# EAGLE design untitled (EAGLE 9.6.2)
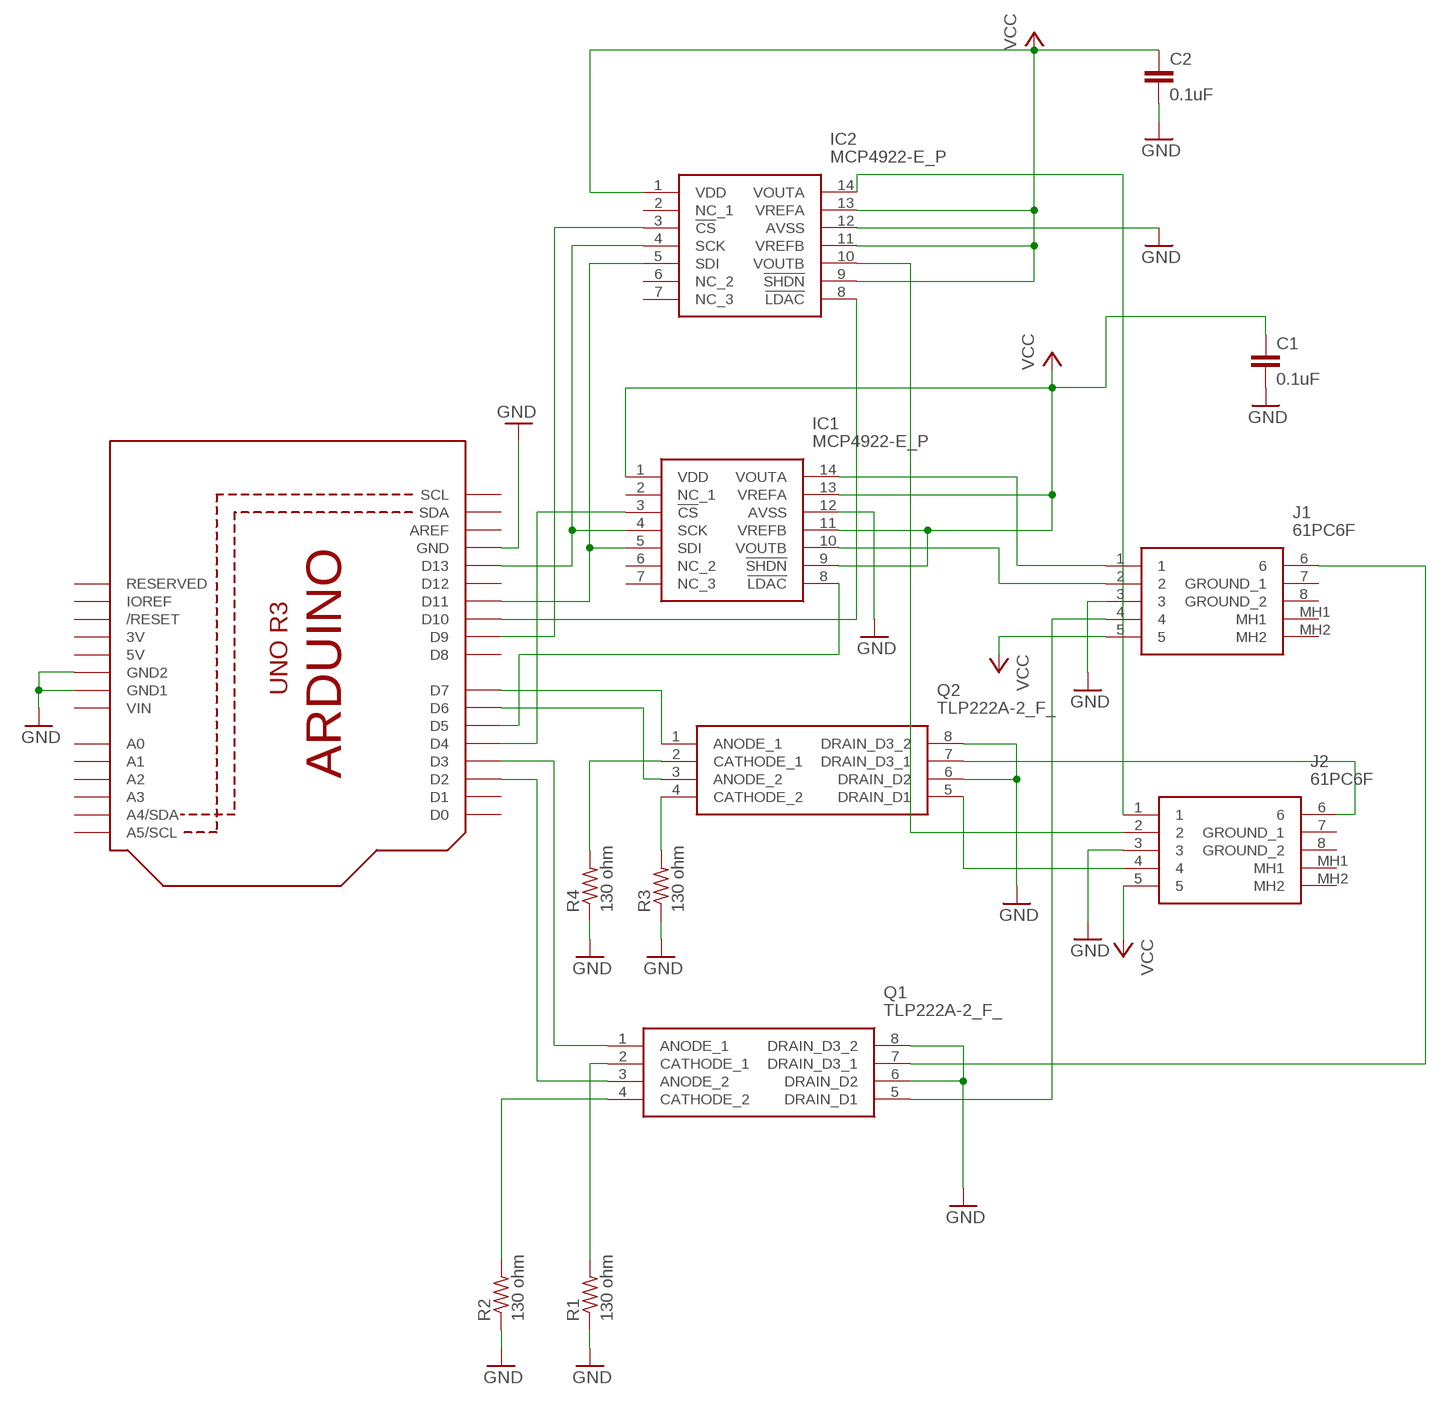
[diagram p0: schematic, sheet 1]

## Parts
C1  0.1uF  C-EU050-024X044  [C050-024X044]
C2  0.1uF  C-EU050-024X044  [C050-024X044]
IC1  MCP4922-E_P  [DIP794W56P254L1905H432Q14N]
IC2  MCP4922-E_P  [DIP794W56P254L1905H432Q14N]
J1  61PC6F  [61PC6F]
J2  61PC6F  [61PC6F]
Q1  TLP222A-2_F_  [DIP762W60P254L966H485Q8N]
Q2  TLP222A-2_F_  [DIP762W60P254L966H485Q8N]
R1  130 ohm  R-US_0207/7  [0207/7]
R2  130 ohm  R-US_0207/7  [0207/7]
R3  130 ohm  R-US_0207/7  [0207/7]
R4  130 ohm  R-US_0207/7  [0207/7]
U1  ARDUINOR3-BPLACE  [ARDUINOR3-BPLACE]

## Nets
GND: C1.2 C2.2 IC1.12(AVSS) IC2.12(AVSS) J1.3 J2.3 Q1.6(DRAIN_D2) Q1.8(DRAIN_D3_2) Q2.6(DRAIN_D2) Q2.8(DRAIN_D3_2) R1.1 R2.1 R3.1 R4.1 U1.GND U1.GND1 U1.GND2
N$1: IC1.4(SCK) IC2.4(SCK) U1.D13
N$2: IC1.5(SDI) IC2.5(SDI) U1.D11
N$3: Q1.2(CATHODE_1) R1.2
N$4: IC1.3(!CS) U1.D4
N$5: IC1.8(!LDAC) U1.D5
N$6: Q1.4(CATHODE_2) R2.2
N$7: Q1.1(ANODE_1) U1.D3
N$8: Q1.3(ANODE_2) U1.D2
N$9: Q2.1(ANODE_1) U1.D7
N$10: J1.6 Q1.7(DRAIN_D3_1)
N$11: J1.4 Q1.5(DRAIN_D1)
N$12: IC1.14(VOUTA) J1.1
N$13: Q2.3(ANODE_2) U1.D6
N$14: IC1.10(VOUTB) J1.2
N$15: Q2.2(CATHODE_1) R4.2
N$16: Q2.4(CATHODE_2) R3.2
N$17: J2.6 Q2.7(DRAIN_D3_1)
N$18: J2.4 Q2.5(DRAIN_D1)
N$20: IC2.3(!CS) U1.D9
N$21: IC2.10(VOUTB) J2.2
N$22: IC2.8(!LDAC) U1.D10
N$23: IC2.14(VOUTA) J2.1
VCC: C1.1 C2.1 IC1.1(VDD) IC1.9(!SHDN) IC1.11(VREFB) IC1.13(VREFA) IC2.1(VDD) IC2.9(!SHDN) IC2.11(VREFB) IC2.13(VREFA) J1.5 J2.5
Unconnected: IC1.2(NC_1) IC1.6(NC_2) IC1.7(NC_3) IC2.2(NC_1) IC2.6(NC_2) IC2.7(NC_3) J1.7(GROUND_1) J1.8(GROUND_2) J1.MH1 J1.MH2 J2.7(GROUND_1) J2.8(GROUND_2) J2.MH1 J2.MH2 U1.A0 U1.A1 U1.A2 U1.A3 U1.A4(A4/SDA) U1.A5(A5/SCL) U1.AREF U1.D0 U1.D1 U1.D8 U1.D12 U1.IOREF U1.RESERVED U1.RESET(/RESET) U1.SCL U1.SDA

## Power pins joined to a net without a drawn wire
3V: U1.3V
5V: U1.5V
VIN: U1.VIN

## Library data of the parts
C1 C2 = rcl:C-EU: CAPACITOR, European symbol; SPICEPREFIX: C
IC1 IC2 = SamacSys_Parts:MCP4922-E_P: Microchip MCP4922-E/P, 2-channel 12 bit Serial DAC, 14-Pin PDIP Source: Datasheet <https://componentsearchengine.com/Datasheets/1/MCP4922-E_P.pdf>; DESCRIPTION: Microchip MCP4922-E/P, 2-channel 12 bit Serial DAC, 14-Pin PDIP; HEIGHT: 4.32mm; MANUFACTURER_NAME: Microchip; MANUFACTURER_PART_NUMBER: MCP4922-E/P; MOUSER_PART_NUMBER: 579-MCP4922-E/P; MOUSER_PRICE-STOCK: https://www.mouser.com/Search/Refine.aspx?Keyword=579-MCP4922-E%2FP
J1 J2 = SamacSys_Parts:61PC6F: Conn Circular DIN F 6 POS Solder RA Thru-Hole 6 Terminal 1 Port Source: Datasheet <https://componentsearchengine.com/Datasheets/1/61PC6F.pdf>; DESCRIPTION: Conn Circular DIN F 6 POS Solder RA Thru-Hole 6 Terminal 1 Port; HEIGHT: 21mm; MANUFACTURER_NAME: Switchcraft; MANUFACTURER_PART_NUMBER: 61PC6F; MOUSER_PART_NUMBER: 502-61PC6F; MOUSER_PRICE-STOCK: https://www.mouser.com/Search/Refine.aspx?Keyword=502-61PC6F
Q1 Q2 = SamacSys_Parts:TLP222A-2_F_: MOSFET Output Optocouplers Photorelay Voff=60V Ion=0.5/0.4A dual Source: Datasheet <https://componentsearchengine.com/Datasheets/1/TLP222A-2(F).pdf>; DESCRIPTION: MOSFET Output Optocouplers Photorelay Voff=60V Ion=0.5/0.4A dual; HEIGHT: 4.85mm; MANUFACTURER_NAME: Toshiba; MANUFACTURER_PART_NUMBER: TLP222A-2(F); MOUSER_PART_NUMBER: 757-TLP222A-2(F); MOUSER_PRICE-STOCK: https://www.mouser.com/Search/Refine.aspx?Keyword=757-TLP222A-2%28F%29
R1-R4 = adafruit:R-US_: RESISTOR, American symbol
U1 = adafruit:ARDUINOR3: This is a new object for the new Arduino R3 - with extra pins that you may want to use (such as IOref, and duplicated A4/A5

## Board
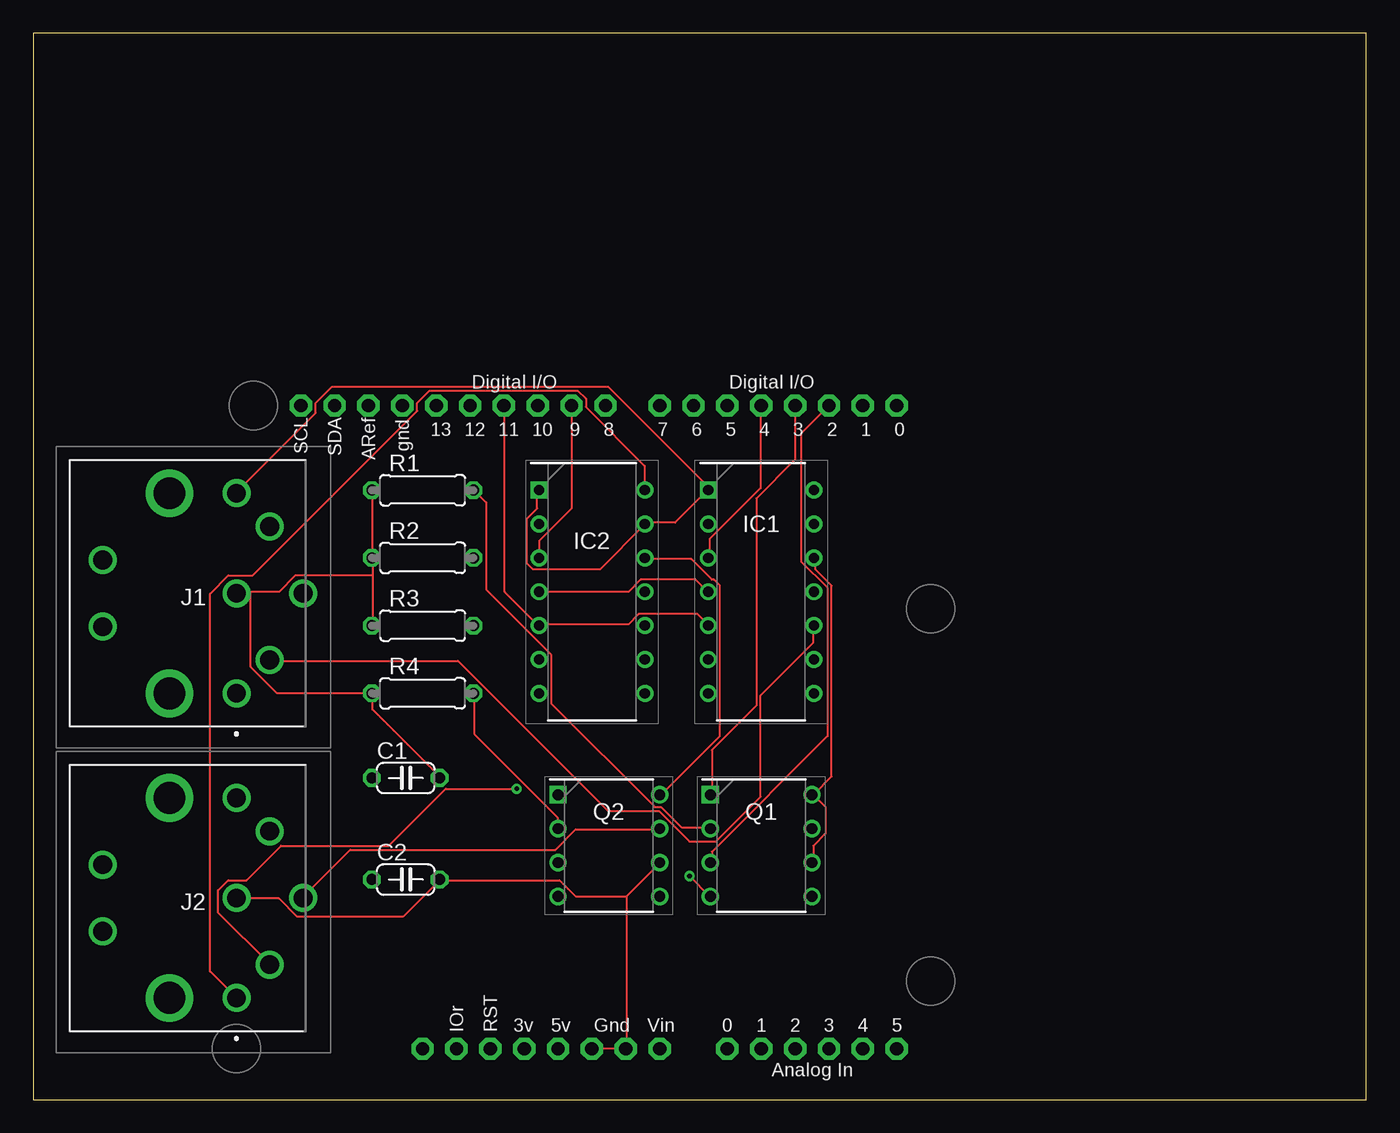
[diagram p1: board, top side]
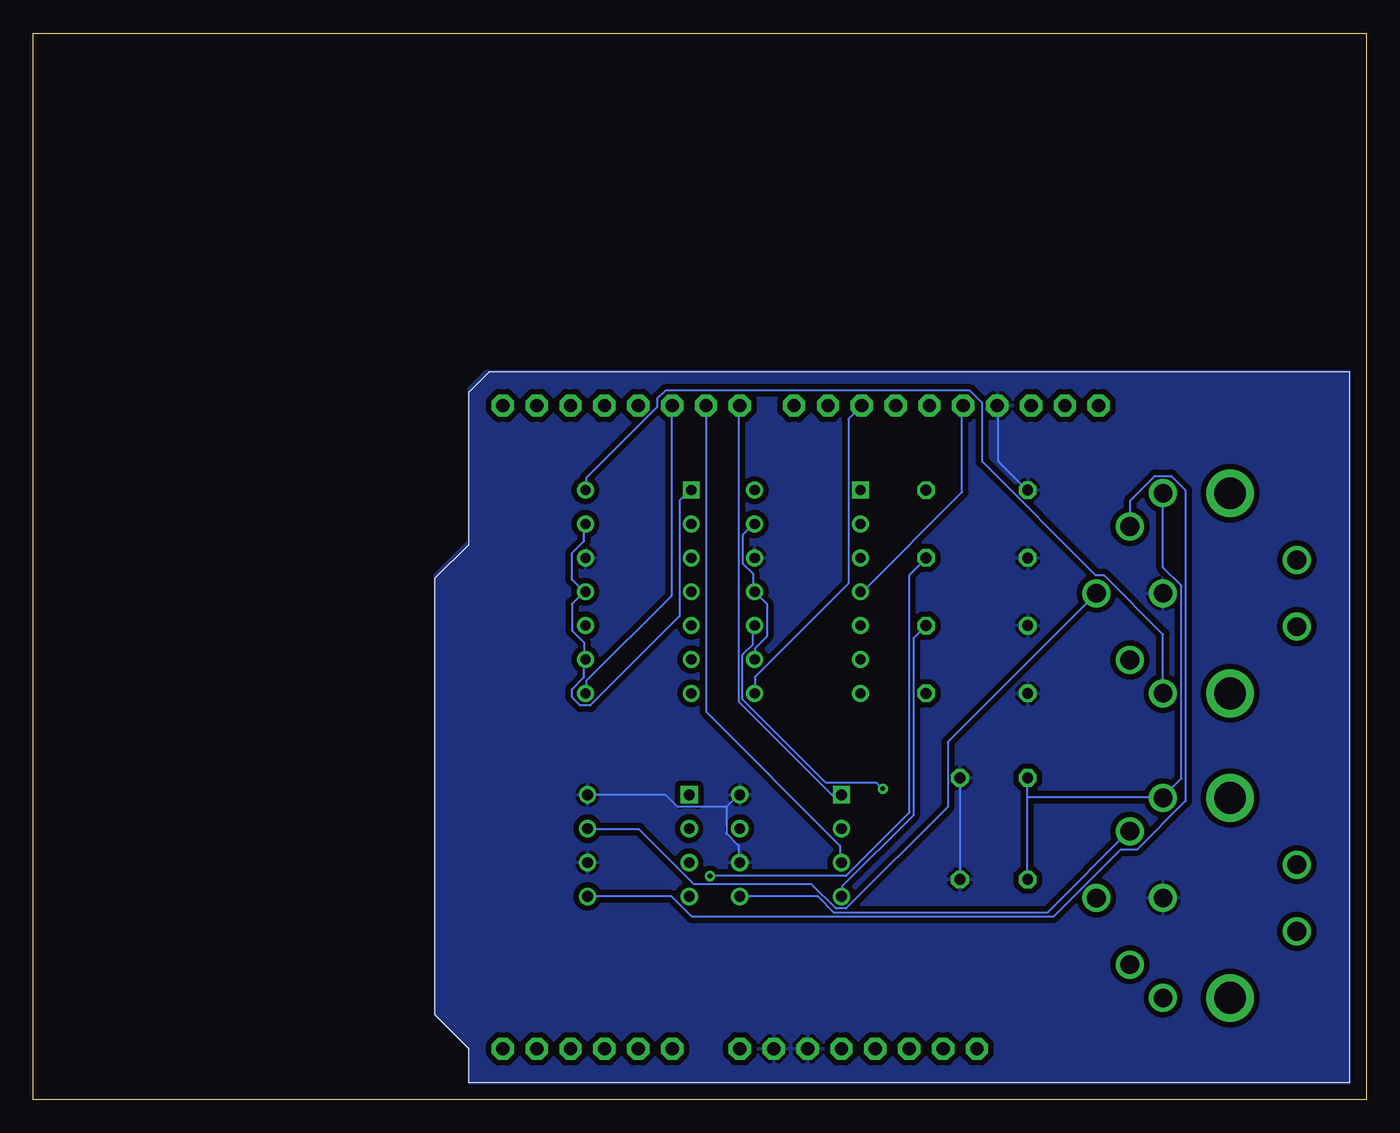
[diagram p2: board, bottom side, seen from below]

Size 100 x 80 mm. Coordinates in mm from the lower left corner, seen from the top.
Outline: 0,0 100,0 100,80 0,80 0,0
Copper layers (1*16): Top 0.035mm / dielectric 1.5mm / Bottom 0.035mm
Design rules "default": minimum track width 6mil, minimum drill 0.35mm, track to track 6mil, track to pad 6mil, pad to pad 6mil, via to via 6mil, smd to smd 6mil, copper to edge 40mil, drill to drill 6mil, minimum pad ring 10mil, minimum via ring 8mil, stop-mask expansion 4mil, vias tented up to drill 0mil, thermal gap 10mil

### Footprints (pad centres in the part's own frame; a part is rotated, then mirrored left to right if it is on the bottom)
C050-024X044 = drill 0.813 octagon: 1 -2.54,0; 2 2.54,0
DIP794W56P254L1905H432Q14N = drill 0.76 pad 1.16 square: 1 -3.97,7.62 | drill 0.76 pad 1.16: 2 -3.97,5.08; 3 -3.97,2.54; 4 -3.97,0; 5 -3.97,-2.54; 6 -3.97,-5.08; 7 -3.97,-7.62; 8 3.97,-7.62; 9 3.97,-5.08; 10 3.97,-2.54; 11 3.97,0; 12 3.97,2.54; 13 3.97,5.08; 14 3.97,7.62
61PC6F = drill 1.4 pad 2.1: 1 0,0; 2 2.49,2.5; 3 0,7.505; 4 2.49,12.51; 5 0,15.01; 6 5,7.505; 7 -10.03,5.005; 8 -10.03,10.005 | drill 2.39 pad 3.585: MH1 -5.03,15.01; MH2 -5.03,0
DIP762W60P254L966H485Q8N = drill 0.8 pad 1.2 square: 1 -3.81,3.81 | drill 0.8 pad 1.2: 2 -3.81,1.27; 3 -3.81,-1.27; 4 -3.81,-3.81; 5 3.81,-3.81; 6 3.81,-1.27; 7 3.81,1.27; 8 3.81,3.81
0207/7 = drill 0.813 octagon: 1 -3.81,0; 2 3.81,0
ARDUINOR3-BPLACE = drill 1 pad 1.676 octagon: 3V 35.56,2.54; 5V 38.1,2.54; A0 50.8,2.54; A1 53.34,2.54; A2 55.88,2.54; A3 58.42,2.54; A4 60.96,2.54; A5 63.5,2.54; AREF 23.876,50.8; D0 63.5,50.8; D1 60.96,50.8; D2 58.42,50.8; D3 55.88,50.8; D4 53.34,50.8; D5 50.8,50.8; D6 48.26,50.8; D7 45.72,50.8; D8 41.656,50.8; D9 39.116,50.8; D10 36.576,50.8; D11 34.036,50.8; D12 31.496,50.8; D13 28.956,50.8; GND 26.416,50.8; GND1 43.18,2.54; GND2 40.64,2.54; IOREF 30.48,2.54; RESERVED 27.94,2.54; RESET 33.02,2.54; SCL 18.796,50.8; SDA 21.336,50.8; VIN 45.72,2.54

### Placement (x,y rotation side)
C1  27.94,24.13 0 top
C2  27.94,16.51 0 top
IC1  54.61,38.1 0 top
IC2  41.91,38.1 0 top
J1  15.24,30.48 0 top
J2  15.24,7.62 0 top
Q1  54.61,19.05 0 top
Q2  43.18,19.05 0 top
R1  29.21,45.72 0 top
R2  29.21,40.64 0 top
R3  29.21,35.56 0 top
R4  29.21,30.48 0 top
U1  1.27,1.27 0 top

### Tracks (layer width: path | path; a pad name or v marks a point on that pad's centre or on a via)
GND
  Top 0.152: 58.52,22.86 59.89,24.23 59.89,38.56 58.67,39.78 58.67,40.54 IC1.12 | 58.52,22.86 59.44,21.95 59.44,19.96 58.52,19.05 58.52,17.83 Q1.6 | 58.52,22.86 Q1.8 | U1.GND2 U1.GND1 44.5,3.81 44.5,15.24 | IC2.12 46.02,40.54 49.38,40.54 50.9,39.01 51.05,39.01 51.51,38.56 51.51,27.28 47.09,22.86 Q2.8 | 44.5,15.24 46.94,17.68 Q2.6 | 25.45,39.32 25.45,40.54 R2.1 25.45,40.69 25.45,45.72 R1.1 | 25.45,39.32 25.45,35.66 R3.1 | 16.31,38.1 18.44,38.1 19.66,39.32 25.45,39.32 | 16.31,38.1 15.24,38.1 J1.3 | C1.2 30.48,24.23 25.45,29.26 25.45,30.48 R4.1 18.29,30.48 16.31,32.46 16.31,38.1 | 30.48,16.46 27.74,13.72 19.81,13.72 18.44,15.09 15.24,15.09 J2.3 | 44.5,15.24 40.69,15.24 39.47,16.46 30.48,16.46 | 30.48,16.46 C2.2
  Bottom 0.152: 48.01,21.95 48.01,19.96 47.09,19.05 47.09,17.83 Q2.6 | 48.01,21.95 47.09,22.86 Q2.8 | Q1.8 52.58,22.86 51.66,21.95 48.01,21.95 | U1.GND 27.58,51.97 27.58,47.85 25.45,45.72 R1.1 | C1.2 C2.2
  pour Bottom (isolate 0.406): 1.27,54.61 66.04,54.61 67.31,53.34 67.31,41.91 69.85,39.37 69.85,6.35 67.31,3.81 67.31,1.27 1.27,1.27
N$1
  Top 0.152: IC2.4 44.65,38.1 45.57,39.01 49.68,39.01 50.6,38.1 IC1.4
  Bottom 0.152: U1.D13 30.33,51.97 30.33,45.57 37.8,38.1 IC2.4
N$2
  Top 0.152: IC1.5 50.6,35.66 49.84,36.42 45.41,36.42 44.65,35.66 37.95,35.66 IC2.5 37.8,35.66 35.36,38.1 35.36,51.97 U1.D11
N$3
  Top 0.152: Q1.2 50.75,20.42 48.62,20.42 47.09,21.95 46.63,21.95 38.86,29.72 38.86,33.38 33.98,38.25 33.98,44.81 33.07,45.72 R1.2
N$4
  Top 0.152: IC1.3 50.75,40.69 50.75,42.06 54.56,45.87 54.56,51.97 U1.D4
N$5
  Bottom 0.152: IC1.8 58.52,30.48 58.52,31.39 52.12,37.8 52.12,51.97 U1.D5
N$6  (via drill 0.35)
  Top 0.152: v49.23,16.76 50.75,15.24 Q1.4
  Bottom 0.152: v49.23,16.76 39.01,16.76 34.29,21.49 34.29,39.32 33.07,40.54 R2.2
N$7
  Top 0.152: U1.D3 57.15,48.01 54.25,45.11 54.25,29.57 50.9,26.21 50.9,22.86 Q1.1
N$8
  Top 0.152: U1.D2 57.61,49.99 57.61,40.39 59.59,38.41 59.59,27.28 50.9,18.59 50.9,17.83 Q1.3
N$9
  Bottom 0.152: Q2.1 40.08,22.86 47.09,29.87 47.09,51.97 U1.D7
N$10
  Bottom 0.152: Q1.7 58.37,20.27 54.56,20.27 50.44,16.15 41.6,16.15 39.78,14.33 39.01,14.33 31.39,21.95 31.39,26.82 20.27,37.95 J1.6
N$11
  Bottom 0.152: Q1.5 52.12,15.24 50.6,13.72 23.47,13.72 18.44,18.75 17.22,18.75 13.56,22.4 13.56,45.72 14.63,46.79 15.85,46.79 17.68,44.96 17.68,43.13 J1.4
N$12
  Bottom 0.152: J1.1 15.24,34.9 19.66,39.32 20.27,39.32 28.8,47.85 28.8,52.27 29.72,53.19 52.58,53.19 53.19,52.58 53.19,51.97 58.52,46.63 58.52,45.72 IC1.14
N$13
  Bottom 0.152: U1.D6 49.53,29.11 39.47,19.05 39.47,17.83 Q2.3
N$14
  Top 0.152: IC1.10 58.52,35.51 58.52,34.29 54.56,30.33 54.56,22.71 51.21,19.36 49.23,19.36 46.94,21.64 43.13,21.64 31.85,32.92 17.83,32.92 J1.2
N$15
  Top 0.152: Q2.2 39.32,20.42 39.32,21.18 33.07,27.43 33.07,30.48 R4.2
N$16
  Bottom 0.152: R3.2 33.98,34.59 33.98,21.34 39.32,16 39.32,15.24 Q2.4
N$17
  Top 0.152: Q2.7 46.94,20.27 40.69,20.27 39.17,18.75 23.77,18.75 20.27,15.24 J2.6
N$18
  Bottom 0.152: Q2.5 41.15,15.24 39.93,14.02 23.93,14.02 17.83,20.12 J2.4
N$20
  Top 0.152: U1.D9 40.39,44.35 37.95,41.91 37.95,40.69 IC2.3
N$21  (via drill 0.35)
  Top 0.152: v36.27,23.32 30.94,23.32 26.67,19.05 18.59,19.05 16,16.46 14.63,16.46 13.87,15.7 13.87,14.02 17.68,10.21 J2.2
  Bottom 0.152: v36.27,23.32 36.73,23.77 40.54,23.77 46.79,30.02 46.79,33.38 46.02,34.14 46.02,35.51 IC2.10
N$22
  Bottom 0.152: U1.D10 38.86,51.05 38.86,38.71 45.87,31.7 IC2.8
N$23
  Top 0.152: J2.1 13.26,9.6 13.26,37.95 14.63,39.32 16.46,39.32 28.8,51.66 28.8,52.27 29.72,53.19 40.84,53.19 41.45,52.58 41.45,51.97 45.87,47.55 IC2.14
VCC
  Top 0.152: 50.6,45.72 48.16,43.28 46.02,43.28 IC2.13 45.87,43.13 42.52,39.78 37.49,39.78 37.03,40.23 37.03,43.59 37.8,44.35 37.8,45.72 IC2.1 | 50.6,45.72 50.6,46.02 43.13,53.49 22.4,53.49 21.18,52.27 21.18,51.51 15.24,45.57 J1.5 | 50.6,45.72 IC1.1
  Bottom 0.152: 58.67,38.1 59.59,37.19 59.59,35.2 58.67,34.29 58.67,33.07 IC1.9 58.67,32.92 58.67,31.7 59.59,30.79 59.59,30.18 58.98,29.57 58.22,29.57 51.51,36.27 51.51,44.96 50.75,45.72 IC1.1 | 58.67,38.1 59.59,39.01 59.59,41 58.67,41.91 58.67,43.13 IC1.13 | 58.67,38.1 IC1.11 | IC2.9 45.87,33.07 45.87,33.83 44.96,34.75 44.96,37.19 IC2.11 46.02,38.1 46.02,39.47 46.79,40.23 46.79,42.37 46.02,43.13 IC2.13 | 25.45,22.71 25.45,24.08 C1.1 | 25.45,22.71 25.45,16.61 C2.1 | 25.45,22.71 15.24,22.71 | J1.5 15.24,39.93 13.87,38.56 13.87,24.08 15.24,22.71 | 15.24,22.71 J2.5